# Altium project BF-6-0-0.PrjPCB
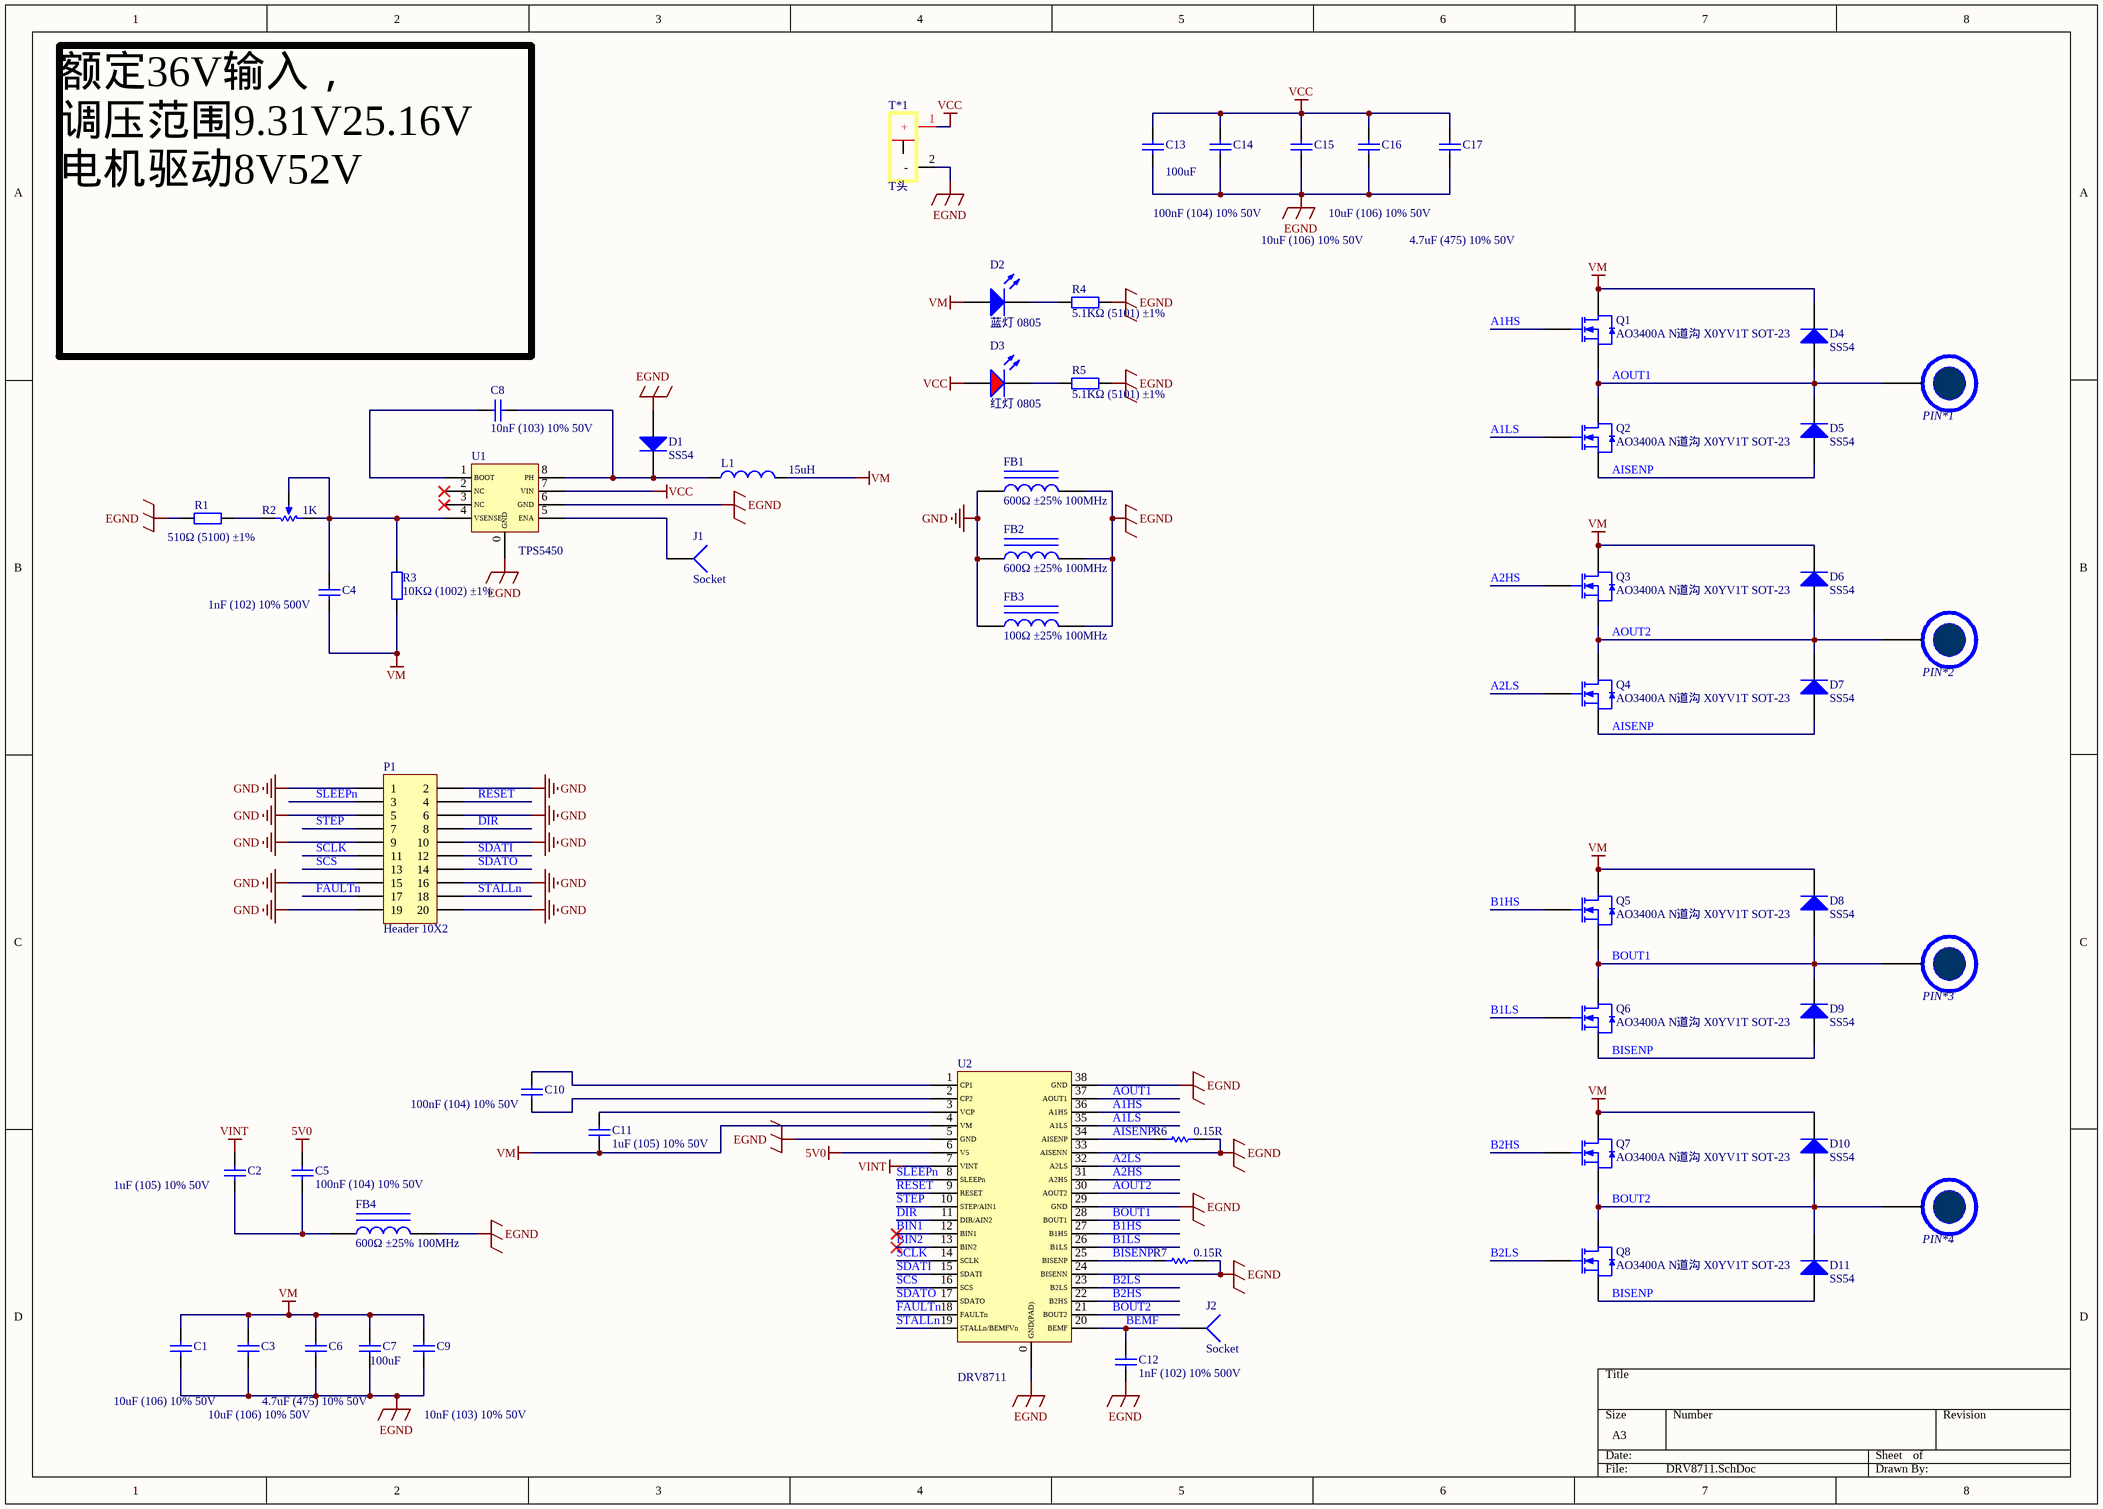
[diagram p0: DRV8711.SchDoc]
1 sheet, 58 parts. Net scope: global (net labels, ports and power ports of the same name join across sheets).
Board file: DRV8711.PcbDoc

## Sheet DRV8711.SchDoc
size A3

### Parts
C1  10uF (106) 10% 50V  [1206_C]
C2  1uF (105) 10% 50V  [0603_C]
C3  10uF (106) 10% 50V  [1206_C]
C4  1nF (102) 10% 500V  [1206_C]
C5  100nF (104) 10% 50V  [0603_C]
C6  4.7uF (475) 10% 50V  [1206_C]
C7  value 100uF  [C100uF]  (hidden comment: Cap)
C8  10nF (103) 10% 50V  [1206_C]
C9  10nF (103) 10% 50V  [0603_C]
C10  100nF (104) 10% 50V  [0603_C]
C11  1uF (105) 10% 50V  [0603_C]
C12  1nF (102) 10% 500V  [1206_C]
C13  value 100uF  [C100uF]  (hidden comment: Cap)
C14  100nF (104) 10% 50V  [0603_C]
C15  10uF (106) 10% 50V  [1206_C]
C16  10uF (106) 10% 50V  [1206_C]
C17  4.7uF (475) 10% 50V  [1206_C]
D1  SS54  [SMA(DO-214AC)_S1]
D2  蓝灯 0805  [0805_LED_S1]
D3  红灯 0805  [0805_LED_S1]
D4  SS54  [SMA(DO-214AC)_S1]
D5  SS54  [SMA(DO-214AC)_S1]
D6  SS54  [SMA(DO-214AC)_S1]
D7  SS54  [SMA(DO-214AC)_S1]
D8  SS54  [SMA(DO-214AC)_S1]
D9  SS54  [SMA(DO-214AC)_S1]
D10  SS54  [SMA(DO-214AC)_S1]
D11  SS54  [SMA(DO-214AC)_S1]
FB1  600Ω ±25% 100MHz  [0805_L]
FB2  600Ω ±25% 100MHz  [0805_L]
FB3  100Ω ±25% 100MHz  [0805_L]
FB4  600Ω ±25% 100MHz  [0805_L]
J1  Socket  [PIN1]
J2  Socket  [PIN1]
L1  value 15uH  [INDP175172X70M]  (hidden comment: Inductor)
P1  Header 10X2  [HDR2X10]
PIN*1  PIN  [PIN]  (value not drawn)
PIN*2  PIN  [PIN]  (value not drawn)
PIN*3  PIN  [PIN]  (value not drawn)
PIN*4  PIN  [PIN]  (value not drawn)
Q1  AO3400A N道沟 X0YV1T SOT-23  [SOT-23-3L]
Q2  AO3400A N道沟 X0YV1T SOT-23  [SOT-23-3L]
Q3  AO3400A N道沟 X0YV1T SOT-23  [SOT-23-3L]
Q4  AO3400A N道沟 X0YV1T SOT-23  [SOT-23-3L]
Q5  AO3400A N道沟 X0YV1T SOT-23  [SOT-23-3L]
Q6  AO3400A N道沟 X0YV1T SOT-23  [SOT-23-3L]
Q7  AO3400A N道沟 X0YV1T SOT-23  [SOT-23-3L]
Q8  AO3400A N道沟 X0YV1T SOT-23  [SOT-23-3L]
R1  510Ω (5100) ±1%  [0805_R]
R2  value 1K  [RP1]  (hidden comment: RPot)
R3  10KΩ (1002) ±1%  [1206_R]
R4  5.1KΩ (5101) ±1%  [0805_R]
R5  5.1KΩ (5101) ±1%  [0805_R]
R6  value 0.15R  [2512]  (hidden comment: Res)
R7  value 0.15R  [2512]  (hidden comment: Res)
T*1  T头  [T插]
U1  TPS5450  [LC-SOP-8_EP_150mil]
U2  DRV8711  [LC-HTSSOP-38]

### Nets
5V0: C5.2 U2.6(V5)
EGND: C1.1 C3.1 C6.2 C7.1 C9.1 C12.1 C13.1 C14.1 C15.1 C16.1 C17.2 D1.1(A) FB1.2 FB2.2 FB3.2 FB4.2 R1.1 R4.2 R5.2 R6.2 R7.2 T*1.2(-) U1.0(GND) U1.6(GND) U2.0(GND(PAD)) U2.5(GND) U2.24(BISENN) U2.29(GND) U2.33(AISENN) U2.38(GND)
GND: FB1.1 FB2.1 FB3.1 P1.1 P1.2 P1.5 P1.6 P1.9 P1.10 P1.15 P1.16 P1.19 P1.20
VCC: C13.2 C14.2 C15.2 C16.2 C17.1 D3.A T*1.1(+) U1.7(VIN)
VINT: C2.2 U2.7(VINT)
VM: C1.2 C3.2 C4.1 C6.1 C7.2 C9.2 C11.1 D2.A D4.2(K) D6.2(K) D8.2(K) D10.2(K) L1.2 Q1.3(D) Q3.3(D) Q5.3(D) Q7.3(D) R3.1 U2.4(VM)
A1HS: Q1.1(G) U2.36(A1HS)
A1LS: Q2.1(G) U2.35(A1LS)
A2HS: Q3.1(G) U2.31(A2HS)
A2LS: Q4.1(G) U2.32(A2LS)
AISENP: D5.1(A) D7.1(A) Q2.2(S) Q4.2(S) R6.1 U2.34(AISENP)
AOUT1: D4.1(A) D5.2(K) PIN*1.1(PIN) Q1.2(S) Q2.3(D) U2.37(AOUT1)
AOUT2: D6.1(A) D7.2(K) PIN*2.1(PIN) Q3.2(S) Q4.3(D) U2.30(AOUT2)
B1HS: Q5.1(G) U2.27(B1HS)
B1LS: Q6.1(G) U2.26(B1LS)
B2HS: Q7.1(G) U2.22(B2HS)
B2LS: Q8.1(G) U2.23(B2LS)
BEMF: C12.2 J2.1 U2.20(BEMF)
BIN1: U2.12(BIN1)
BIN2: U2.13(BIN2)
BISENP: D9.1(A) D11.1(A) Q6.2(S) Q8.2(S) R7.1 U2.25(BISENP)
BOUT1: D8.1(A) D9.2(K) PIN*3.1(PIN) Q5.2(S) Q6.3(D) U2.28(BOUT1)
BOUT2: D10.1(A) D11.2(K) PIN*4.1(PIN) Q7.2(S) Q8.3(D) U2.21(BOUT2)
DIR: P1.8 U2.11(DIR/AIN2)
FAULTn: P1.17 U2.18(FAULTn)
RESET: P1.4 U2.9(RESET)
SCLK: P1.11 U2.14(SCLK)
SCS: P1.13 U2.16(SCS)
SDATI: P1.12 U2.15(SDATI)
SDATO: P1.14 U2.17(SDATO)
SLEEPn: P1.3 U2.8(SLEEPn)
STALLn: P1.18 U2.19(STALLn/BEMFVn)
STEP: P1.7 U2.10(STEP/AIN1)
NetC2_1: C2.1 C5.1 FB4.1
NetC4_2: C4.2 R2.2(TAP) R2.3(BOT) R3.2 U1.4(VSENSE)
NetC8_1: C8.1 U1.1(BOOT)
NetC8_2: C8.2 D1.2(K) L1.1 U1.8(PH)
NetC10_1: C10.1 U2.2(CP2)
NetC10_2: C10.2 U2.1(CP1)
NetC11_2: C11.2 U2.3(VCP)
NetD2_K: D2.K R4.1
NetD3_K: D3.K R5.1
NetJ1_1: J1.1 U1.5(ENA)
NetR1_2: R1.2 R2.1(TOP)

Not connected (* = marked no-connect by the designer): U1 2(NC)* 3(NC)*

### Notes on the sheet
- 额定36V输入，
  调压范围9.31V25.16V
  电机驱动8V52V

### Library data of the parts
C1 C3 C15 C16 = 1206 10uF (106) 10% 50V: 贴片电容; ComponentLink1Description: 供应商链接; ComponentLink1URL: http://www.szlcsc.com/product/details_14236.html; Package: 1206; Supplier: LC; SuppliersPartNumber: C13585
C2 C11 = 0603 1uF (105) 10% 50V: 贴片电容; ComponentLink1Description: 供应商链接; ComponentLink1URL: http://www.szlcsc.com/product/details_16531.html; Package: 0603; Supplier: LC; SuppliersPartNumber: C15849
C4 C12 = 1206 1nF (102) 10% 500V: 贴片电容; ComponentLink1Description: 供应商链接; ComponentLink1URL: http://www.szlcsc.com/product/details_36187.html; Package: 1206; Supplier: LC; SuppliersPartNumber: C35216
C5 C10 C14 = 0603 100nF (104) 10% 50V: 贴片电容; ComponentLink1Description: 供应商链接; ComponentLink1URL: http://www.szlcsc.com/product/details_15331.html; Package: 0603; Supplier: LC; SuppliersPartNumber: C14663
C6 C17 = 1206 4.7uF (475) 10% 50V: 贴片电容; ComponentLink1Description: 供应商链接; ComponentLink1URL: http://www.szlcsc.com/product/details_30577.html; Package: 1206; Supplier: LC; SuppliersPartNumber: C29823
C7 C13 = Cap: 贴片电容; Published: 8-Jun-2000; LatestRevisionDate: 17-Jul-2002; LatestRevisionNote: Re-released for DXP Platform.; PackageReference: RAD-0.3; Publisher: Altium Limited
C8 = 1206 10nF (103) 10% 50V: 贴片电容; ComponentLink1Description: 供应商链接; ComponentLink1URL: http://www.szlcsc.com/product/details_2198.html; Package: 1206; Supplier: LC; SuppliersPartNumber: C1846
C9 = 0603 10nF (103) 10% 50V: 贴片电容; ComponentLink1Description: 供应商链接; ComponentLink1URL: http://www.szlcsc.com/product/details_58143.html; Package: 0603; Supplier: LC; SuppliersPartNumber: C57112
D1 D4-D11 = SMA(DO-214AC) SS54: 二极管; ComponentLink1Description: 供应商链接; ComponentLink1URL: http://www.szlcsc.com/product/details_23178.html; Package: SMA(DO-214AC); Supplier: LC; SuppliersPartNumber: C22452
D2 = 0805 蓝灯: 发光二极管; ComponentLink1Description: 供应商链接; ComponentLink1URL: http://www.szlcsc.com/product/details_2666.html; Package: 0805; Supplier: LC; SuppliersPartNumber: C2293
D3 = 0805 红灯: 发光二极管; ComponentLink1Description: 供应商链接; ComponentLink1URL: http://www.szlcsc.com/product/details_2668.html; Package: 0805; Supplier: LC; SuppliersPartNumber: C2295
FB1 FB2 FB4 = 0805 600Ω 25% 100MHz: 贴片磁珠; ComponentLink1Description: 供应商链接; ComponentLink1URL: http://www.szlcsc.com/product/details_1369.html; Package: 0805; Supplier: LC; SuppliersPartNumber: C1017
FB3 = 0805 100Ω 25% 100MHz: 贴片磁珠; ComponentLink1Description: 供应商链接; ComponentLink1URL: http://www.szlcsc.com/product/details_1367.html; Package: 0805; Supplier: LC; SuppliersPartNumber: C1015
L1 = Inductor: Code_IEC: 1005; Published: 8-Jun-2000; LatestRevisionDate: 29-May-2009; LatestRevisionNote: IPC-7351 Footprint Added.; PackageReference: 0402-A; Publisher: Altium Limited; PackageDescription: Chip Inductor; Code_JEITA: 0402
P1 = Header 10X2: Header, 10-Pin, Dual row; LatestRevisionDate: 17-Jul-2002; LatestRevisionNote: Re-released for DXP Platform.; Publisher: Altium Limited
Q1-Q8 = AO3400A N道沟 X0YV1T SOT-23: MOS(场效应管); ComponentLink1Description: 供应商链接; ComponentLink1URL: http://www.szlcsc.com/product/details_21629.html; Package: SOT-23; Supplier: LC; SuppliersPartNumber: C20917
R1 = 0805 510Ω (5100) 1%: 贴片电阻; ComponentLink1Description: 供应商链接; ComponentLink1URL: http://www.szlcsc.com/product/details_18422.html; Package: 0805; Supplier: LC; SuppliersPartNumber: C17734
R2 = RPot: 电位器; Sim Note: Enter the Resistance value and the set point into parameter fields.; Set Position: 0.5; Published: 8-Jun-2000; LatestRevisionDate: 17-Jul-2002; LatestRevisionNote: Re-released for DXP Platform.; PackageReference: VR5; Publisher: Altium Limited
R3 = 1206 10KΩ (1002) 1%: 贴片电阻; ComponentLink1Description: 供应商链接; ComponentLink1URL: http://www.szlcsc.com/product/details_18590.html; Package: 1206; Supplier: LC; SuppliersPartNumber: C17902
R4 R5 = 0805 5.1KΩ (5101) 1%: 贴片电阻; ComponentLink1Description: 供应商链接; ComponentLink1URL: http://www.szlcsc.com/product/details_28584.html; Package: 0805; Supplier: LC; SuppliersPartNumber: C27834
R6 R7 = Res: 贴片电阻; Published: 8-Jun-2000; LatestRevisionDate: 17-Jul-2002; LatestRevisionNote: Re-released for DXP Platform.; PackageReference: AXIAL-0.3; Publisher: Altium Limited
J1 J2 = Socket: LatestRevisionDate: 17-Jul-2002; LatestRevisionNote: Re-released for DXP Platform.; Publisher: Altium Limited